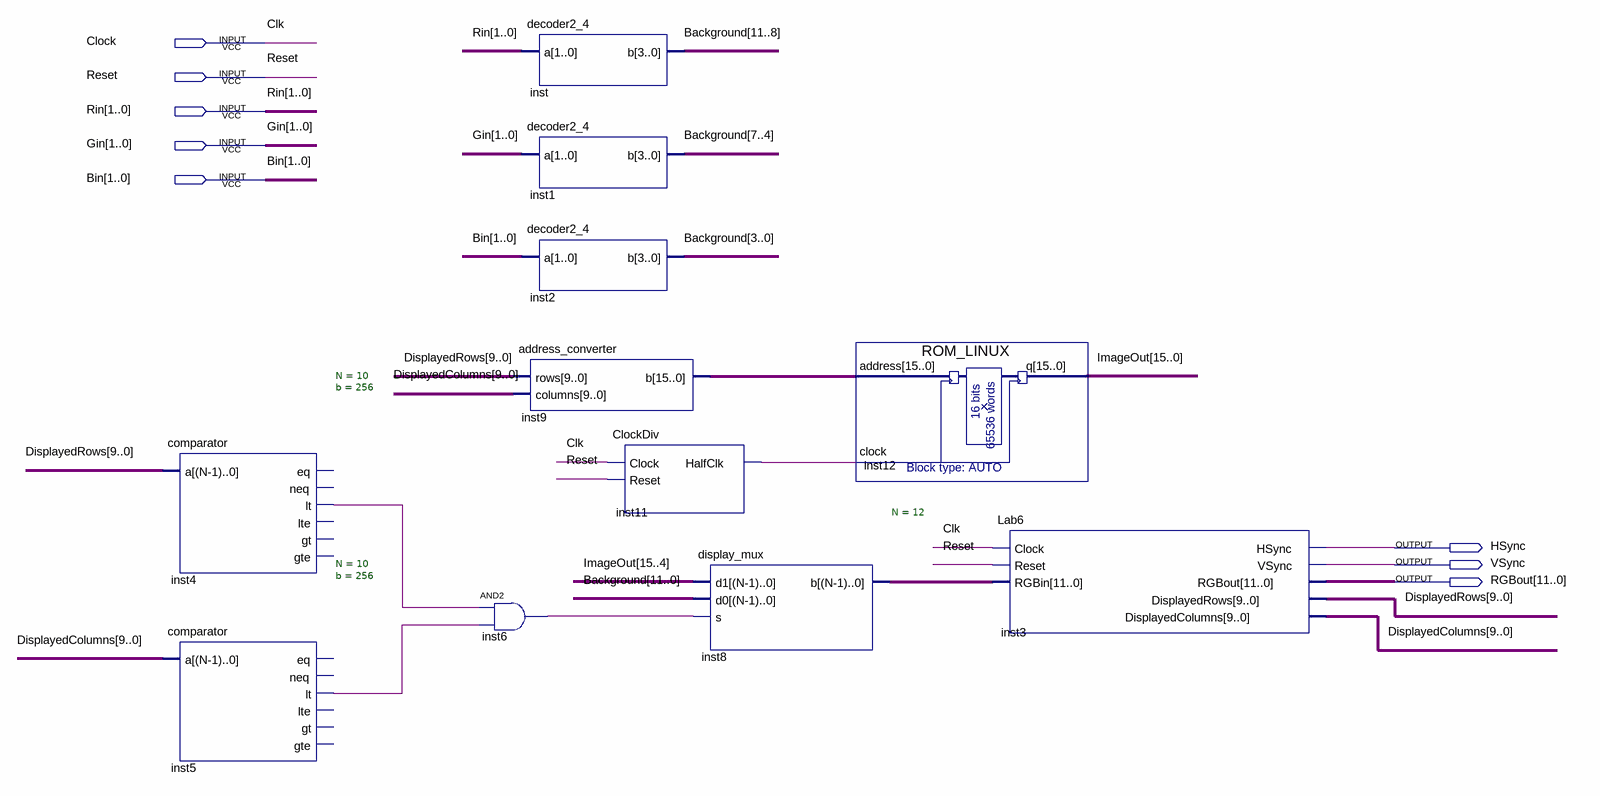
[diagram p0: schematic sheet]
// Quartus schematic Lab7.bdf as structural Verilog: 11 symbols, 8 pins
module Lab7 (
  input  Clock,
  input  Reset,
  input  [1:0] Rin,
  input  [1:0] Gin,
  input  [1:0] Bin,
  output HSync,
  output VSync,
  output [11:0] RGBout
);

  wire inst4_lt, inst5_lt, inst6_out, inst11_halfclk;
  wire [9:0] DisplayedColumns, DisplayedRows;
  wire [11:0] Background, inst8_b;
  wire [15:0] ImageOut, inst9_b;

  comparator #(.N(10), .b(256)) inst4 (.a(DisplayedRows), .lt(inst4_lt));  // open: eq, neq, lte, gt, gte
  comparator #(.N(10), .b(256)) inst5 (.a(DisplayedColumns), .lt(inst5_lt));  // open: eq, neq, lte, gt, gte
  and inst6 (inst6_out, inst4_lt, inst5_lt);
  decoder2_4 inst (.a(Rin), .b(Background[11:8]));
  decoder2_4 inst1 (.a(Gin), .b(Background[7:4]));
  decoder2_4 inst2 (.a(Bin), .b(Background[3:0]));
  address_converter inst9 (.rows(DisplayedRows), .columns(DisplayedColumns), .b(inst9_b));
  ClockDiv inst11 (.Clock(Clock), .Reset(Reset), .HalfClk(inst11_halfclk));
  display_mux #(.N(12)) inst8 (.d1(ImageOut[15:4]), .d0(Background), .s(inst6_out), .b(inst8_b));
  ROM_LINUX inst12 (.address(inst9_b), .clock(inst11_halfclk), .q(ImageOut));
  Lab6 inst3 (
    .Clock(Clock), .Reset(Reset), .RGBin(inst8_b), .HSync(HSync), .VSync(VSync), .RGBout(RGBout),
    .DisplayedRows(DisplayedRows), .DisplayedColumns(DisplayedColumns));

  // Other names for the same wires on the sheet: Clk = Clock
endmodule
